# Altium schematic sheet LionIRVT-TM4C_Main.SchDoc
size A3
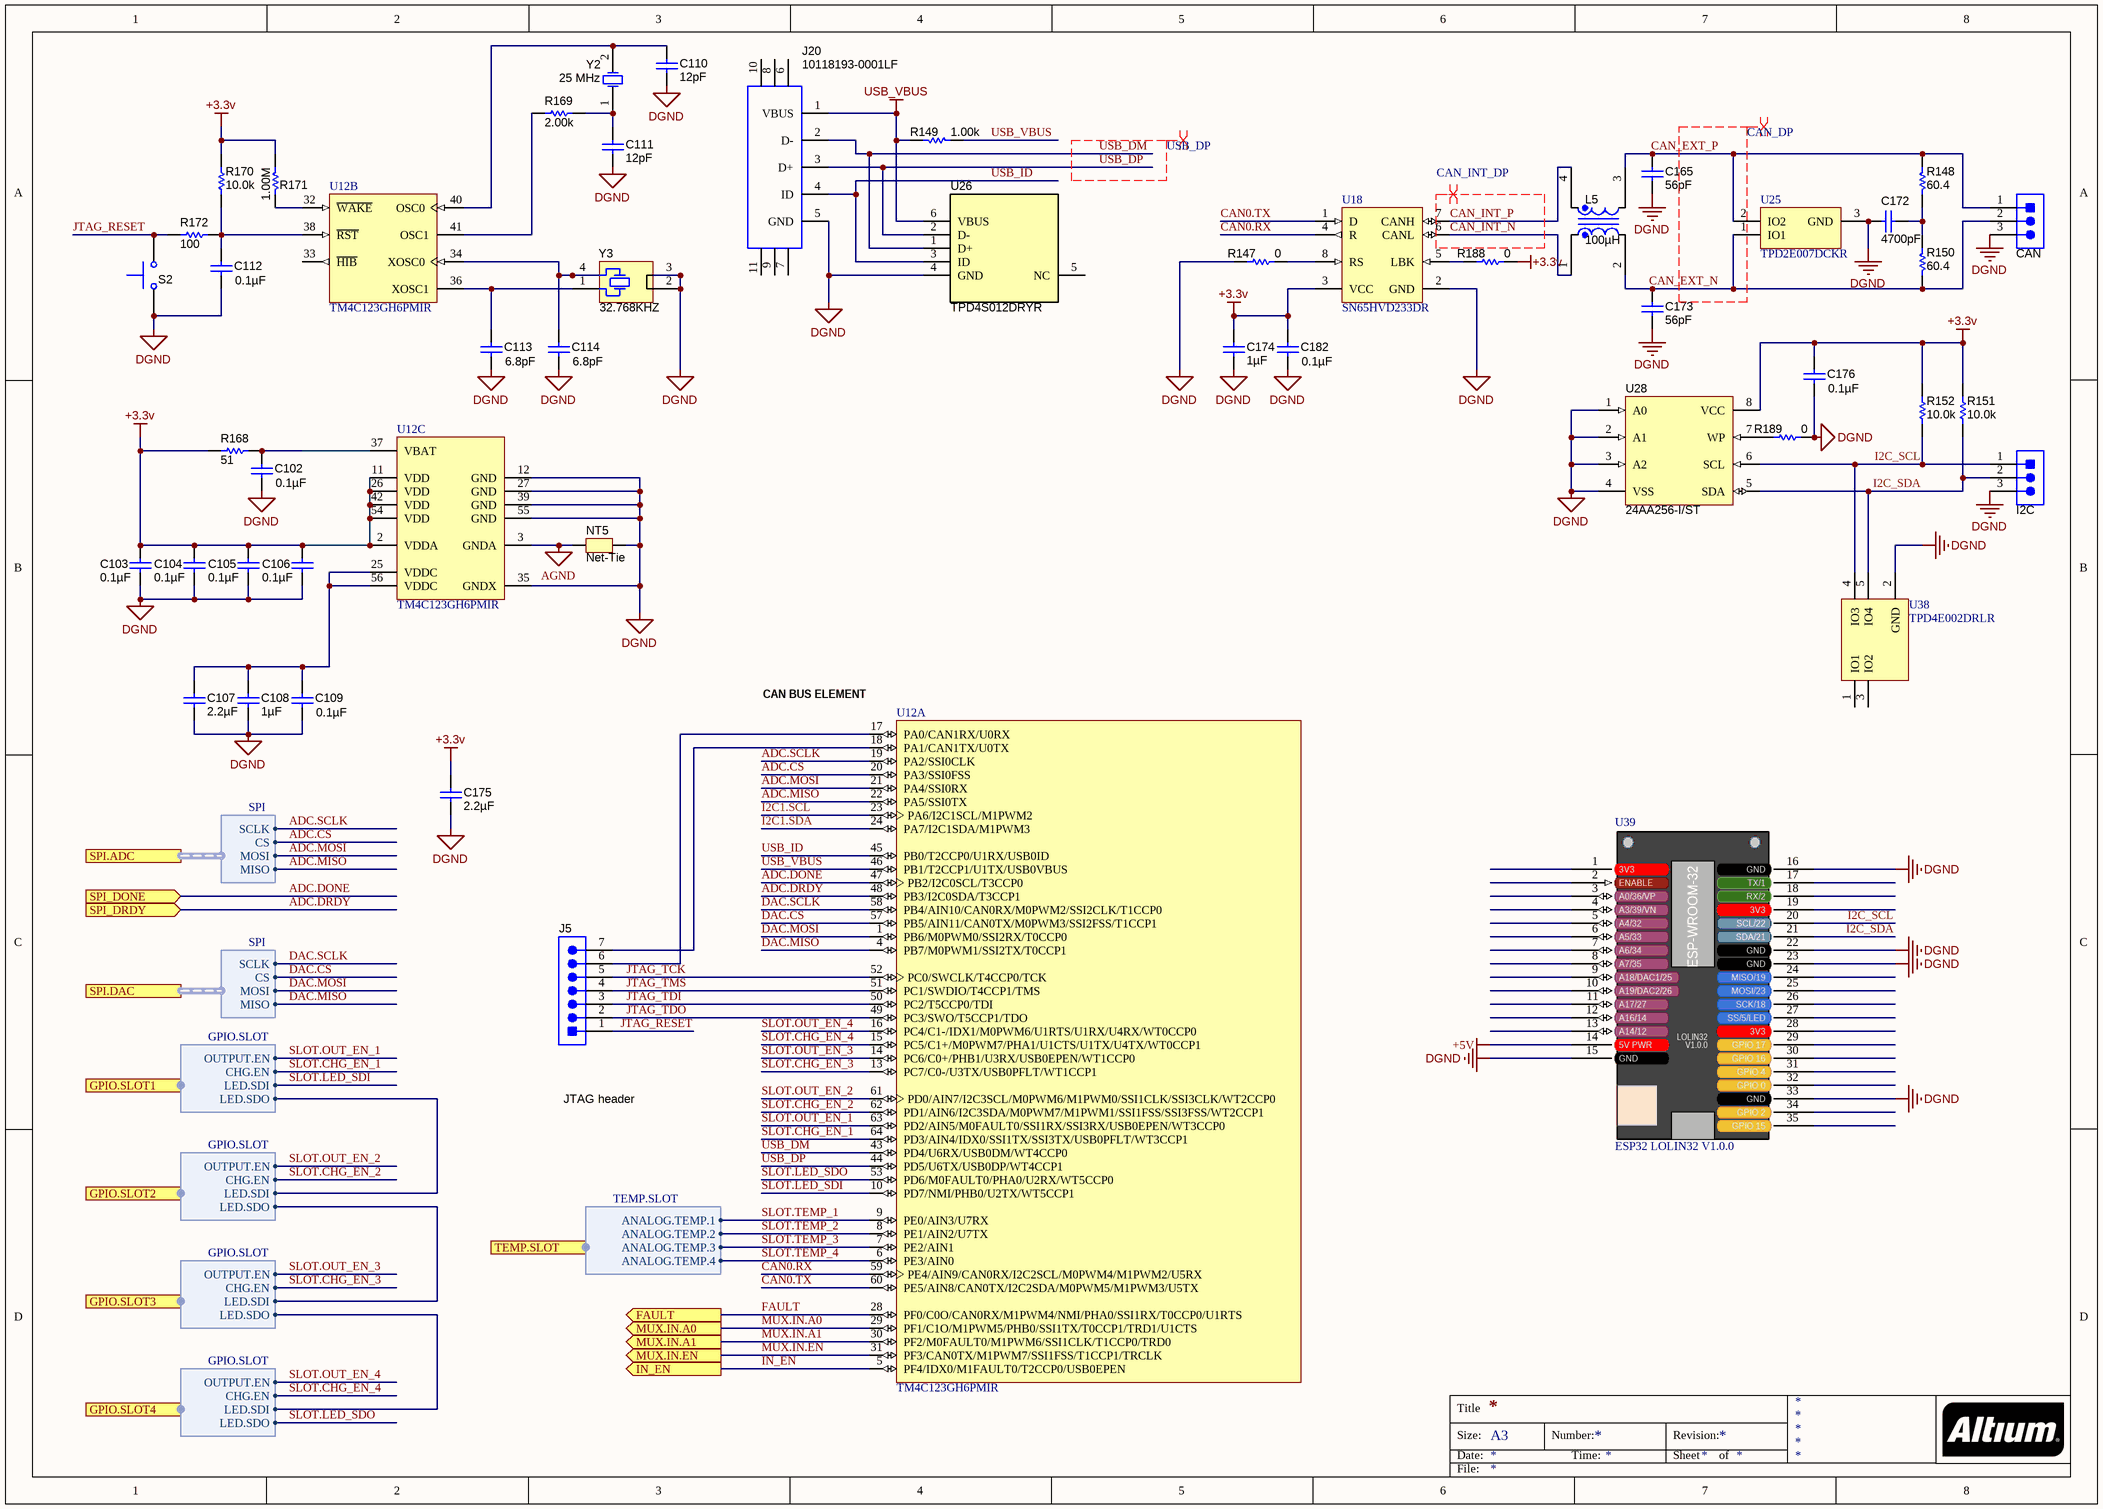
[diagram p0: LionIRVT-TM4C_Main.SchDoc]

## Parts
C102  ValueDisplayed: 0.1µF  [0603C]  (hidden comment: 06033C104JAT2A)
C103  ValueDisplayed: 0.1µF  [0603C]  (hidden comment: 06033C104JAT2A)
C104  ValueDisplayed: 0.1µF  [0603C]  (hidden comment: 06033C104JAT2A)
C105  ValueDisplayed: 0.1µF  [0603C]  (hidden comment: 06033C104JAT2A)
C106  ValueDisplayed: 0.1µF  [0603C]  (hidden comment: 06033C104JAT2A)
C107  ValueDisplayed: 2.2µF  [0603C]  (hidden comment: GRM188R6YA225KA12D)
C108  ValueDisplayed: 1µF  [0603C]  (hidden comment: GRM188R71E105KA12D)
C109  ValueDisplayed: 0.1µF  [0603C]  (hidden comment: 06033C104JAT2A)
C110  ValueDisplayed: 12pF  [0603C]  (hidden comment: C0603C120J5GACTU)
C111  ValueDisplayed: 12pF  [0603C]  (hidden comment: C0603C120J5GACTU)
C112  ValueDisplayed: 0.1µF  [0603C]  (hidden comment: 06033C104JAT2A)
C113  ValueDisplayed: 6.8pF  [0603C]  (hidden comment: 06035A6R8CAT2A)
C114  ValueDisplayed: 6.8pF  [0603C]  (hidden comment: 06035A6R8CAT2A)
C165  ValueDisplayed: 56pF  [0603C]  (hidden comment: GRM1885C1H560JA01D)
C172  ValueDisplayed: 4700pF  [0603C]  (hidden comment: GCM188R71H472KA37D)
C173  ValueDisplayed: 56pF  [0603]  (hidden comment: GRM1885C1H560JA01D)
C174  ValueDisplayed: 1µF  [0603]  (hidden comment: GRM188R71E105KA12D)
C175  ValueDisplayed: 2.2µF  [0603]  (hidden comment: GRM188R6YA225KA12D)
C176  ValueDisplayed: 0.1µF  [0603C]  (hidden comment: 06033C104JAT2A)
C182  ValueDisplayed: 0.1µF  [0603C]  (hidden comment: 06033C104JAT2A)
CAN  ED555/3DS  [TERM_BLK_ED555-3DS]  (value not drawn)
I2C  ED555/3DS  [TERM_BLK_ED555-3DS]  (value not drawn)
J5  TSW-107-07-G-S  [TSW-107-07-G-S]  (value not drawn)
J20  10118193-0001LF  [FCI_10118193-0001LF]
L5  ValueDisplayed: 100µH  [SIMDAD_1812]  (hidden comment: B82789C0104H001)
NT5  Net-Tie  [Net-Tie_10mil]  (net tie, no BOM)
R147  ValueDisplayed: 0  [0603R]  (hidden comment: Resistor)
R148  ValueDisplayed: 60.4  [1206R]  (hidden comment: CRCW120660R4FKEA)
R149  ValueDisplayed: 1.00k  [0603R]  (hidden comment: CRCW06031K00FKEA)
R150  ValueDisplayed: 60.4  [1206R]  (hidden comment: CRCW120660R4FKEA)
R151  ValueDisplayed: 10.0k  [0603R]  (hidden comment: CRCW060310K0FKEA)
R152  ValueDisplayed: 10.0k  [0603R]  (hidden comment: CRCW060310K0FKEA)
R168  ValueDisplayed: 51  [0603R]  (hidden comment: CRCW060351R0JNEA)
R169  ValueDisplayed: 2.00k  [0603R]  (hidden comment: CRCW06032K00FKEA)
R170  ValueDisplayed: 10.0k  [0603R]  (hidden comment: CRCW060310K0FKEA)
R171  ValueDisplayed: 1.00M  [0603R]  (hidden comment: CRCW06031M00FKEA)
R172  ValueDisplayed: 100  [0603R]  (hidden comment: CRCW0603100RFKEA)
R188  ValueDisplayed: 0  [0603R]  (hidden comment: Resistor)
R189  ValueDisplayed: 0  [0603R]  (hidden comment: Resistor)
S2  TL1015AF160QG  [SW_TL1015AF160QG]  (value not drawn)
U12  TM4C123GH6PMIR  [PM0064A_L]  (parts A,B,C of 3)
U18  SN65HVD233DR  [D0008A_M]
U25  TPD2E007DCKR  [DCK0003A_M]
U26  TPD4S012DRYR  [DRY0006A]
U28  24AA256-I/ST  [TSSOP-8]
U38  TPD4E002DRLR  [DRL0005A_L]
U39  ESP32 LOLIN32 V1.0.0  [ESP32_LOLIN32_V1]
Y2  Frequency: 25 MHz  [XTAL_ABM3]  (hidden comment: ABM3-25.000MHZ-D2Y-T)
Y3  Frequency: 32.768KHZ  [Seiko_SSP-T]  (hidden comment: SSPT7F-7PF20-R)

## Ports
FAULT (out), GPIO.SLOT1 (harness GPIO.SLOT), GPIO.SLOT2 (harness GPIO.SLOT), GPIO.SLOT3 (harness GPIO.SLOT), GPIO.SLOT4 (harness GPIO.SLOT), IN_EN (out), MUX.IN.A0 (out), MUX.IN.A1 (out), MUX.IN.EN (out), SPI.ADC (harness SPI), SPI.DAC (harness SPI), SPI_DONE (in), SPI_DRDY (in), TEMP.SLOT (harness TEMP.SLOT)

## Harnesses
SPI: CS, MISO, MOSI, SCLK
GPIO.SLOT: LED.SDI, CHG.EN, LED.SDO, OUTPUT.EN
GPIO.SLOT: CHG.EN, OUTPUT.EN, LED.SDO, LED.SDI
GPIO.SLOT: CHG.EN, OUTPUT.EN, LED.SDI, LED.SDO
TEMP.SLOT: ANALOG.TEMP.1, ANALOG.TEMP.2, ANALOG.TEMP.3, ANALOG.TEMP.4

## Nets
+3.3v: C103.2 C104.2 C105.2 C106.2 C174.1 C175.1 C176.2 C182.2 R151.2 R152.2 R168.1 R170.2 R171.2 R188.2 U12.2(VDDA) U12.11(VDD) U12.26(VDD) U12.42(VDD) U12.54(VDD) U18.3(VCC) U28.8(VCC)
+5V: U39.14(5V_PWR)
AGND: NT5.1 U12.3(GNDA)
DGND: C102.1 C103.1 C104.1 C105.1 C106.1 C107.2 C108.2 C109.1 C110.2 C111.2 C112.1 C113.1 C114.1 C165.2 C172.1 C173.2 C174.2 C175.2 C176.1 C182.1 CAN.3 I2C.3 J20.5(GND) NT5.2 R147.1 R189.2 S2.1 U12.12(GND) U12.27(GND) U12.35(GNDX) U12.39(GND) U12.55(GND) U18.2(GND) U25.3(GND) U26.4(GND) U28.1(A0) U28.2(A1) U28.3(A2) U28.4(VSS) U38.2(GND) U39.15(GND) U39.16(GND) U39.22(GND) U39.23(GND) U39.33(GND) Y3.2 Y3.3
USB_VBUS: J20.1(VBUS) R149.1 R149.2 U12.46(PB1/T2CCP1/U1TX/USB0VBUS) U26.6(VBUS)
ADC.CS: U12.20(PA3/SSI0FSS) ; port SPI.ADC.CS
ADC.DONE: U12.47(PB2/I2C0SCL/T3CCP0) ; port SPI_DONE
ADC.DRDY: U12.48(PB3/I2C0SDA/T3CCP1) ; port SPI_DRDY
ADC.MISO: U12.22(PA5/SSI0TX) ; port SPI.ADC.MISO
ADC.MOSI: U12.21(PA4/SSI0RX) ; port SPI.ADC.MOSI
ADC.SCLK: U12.19(PA2/SSI0CLK) ; port SPI.ADC.SCLK
CAN0.RX: U12.59(PE4/AIN9/CAN0RX/I2C2SCL/M0PWM4/M1PWM2/U5RX) U18.4(R)
CAN0.TX: U12.60(PE5/AIN8/CAN0TX/I2C2SDA/M0PWM5/M1PWM3/U5TX) U18.1(D)
CAN_EXT_N: C173.1 CAN.2 L5.2 R150.1 U25.1(IO1)
CAN_EXT_P: C165.1 CAN.1 L5.3 R148.2 U25.2(IO2)
CAN_INT_N: L5.1 U18.6(CANL)
CAN_INT_P: L5.4 U18.7(CANH)
DAC.CS: U12.57(PB5/AIN11/CAN0TX/M0PWM3/SSI2FSS/T1CCP1) ; port SPI.DAC.CS
DAC.MISO: U12.4(PB7/M0PWM1/SSI2TX/T0CCP1) ; port SPI.DAC.MISO
DAC.MOSI: U12.1(PB6/M0PWM0/SSI2RX/T0CCP0) ; port SPI.DAC.MOSI
DAC.SCLK: U12.58(PB4/AIN10/CAN0RX/M0PWM2/SSI2CLK/T1CCP0) ; port SPI.DAC.SCLK
FAULT: U12.28(PF0/C0O/CAN0RX/M1PWM4/NMI/PHA0/SSI1RX/T0CCP0/U1RTS) ; port FAULT
I2C1.SCL: U12.23(PA6/I2C1SCL/M1PWM2)
I2C1.SDA: U12.24(PA7/I2C1SDA/M1PWM3)
I2C_SCL: I2C.1 R152.1 U28.6(SCL) U38.4(IO3) U39.20(SCL/22)
I2C_SDA: I2C.2 R151.1 U28.5(SDA) U38.5(IO4) U39.21(SDA/21)
IN_EN: U12.5(PF4/IDX0/M1FAULT0/T2CCP0/USB0EPEN) ; port IN_EN
JTAG_RESET: J5.1 R172.1 S2.2
JTAG_TCK: J5.5 U12.52(PC0/SWCLK/T4CCP0/TCK)
JTAG_TDI: J5.3 U12.50(PC2/T5CCP0/TDI)
JTAG_TDO: J5.2 U12.49(PC3/SWO/T5CCP1/TDO)
JTAG_TMS: J5.4 U12.51(PC1/SWDIO/T4CCP1/TMS)
MUX.IN.A0: U12.29(PF1/C1O/M1PWM5/PHB0/SSI1TX/T0CCP1/TRD1/U1CTS) ; port MUX.IN.A0
MUX.IN.A1: U12.30(PF2/M0FAULT0/M1PWM6/SSI1CLK/T1CCP0/TRD0) ; port MUX.IN.A1
MUX.IN.EN: U12.31(PF3/CAN0TX/M1PWM7/SSI1FSS/T1CCP1/TRCLK) ; port MUX.IN.EN
SLOT.CHG_EN_1: U12.64(PD3/AIN4/IDX0/SSI1TX/SSI3TX/USB0PFLT/WT3CCP1) ; port GPIO.SLOT1.CHG.EN
SLOT.CHG_EN_2: U12.62(PD1/AIN6/I2C3SDA/M0PWM7/M1PWM1/SSI1FSS/SSI3FSS/WT2CCP1) ; port GPIO.SLOT2.CHG.EN
SLOT.CHG_EN_3: U12.13(PC7/C0-/U3TX/USB0PFLT/WT1CCP1) ; port GPIO.SLOT3.CHG.EN
SLOT.CHG_EN_4: U12.15(PC5/C1+/M0PWM7/PHA1/U1CTS/U1TX/U4TX/WT0CCP1) ; port GPIO.SLOT4.CHG.EN
SLOT.LED_SDI: U12.10(PD7/NMI/PHB0/U2TX/WT5CCP1) ; port GPIO.SLOT1.LED.SDI
SLOT.LED_SDO: U12.53(PD6/M0FAULT0/PHA0/U2RX/WT5CCP0) ; port GPIO.SLOT4.LED.SDO
SLOT.OUT_EN_1: U12.63(PD2/AIN5/M0FAULT0/SSI1RX/SSI3RX/USB0EPEN/WT3CCP0) ; port GPIO.SLOT1.OUTPUT.EN
SLOT.OUT_EN_2: U12.61(PD0/AIN7/I2C3SCL/M0PWM6/M1PWM0/SSI1CLK/SSI3CLK/WT2CCP0) ; port GPIO.SLOT2.OUTPUT.EN
SLOT.OUT_EN_3: U12.14(PC6/C0+/PHB1/U3RX/USB0EPEN/WT1CCP0) ; port GPIO.SLOT3.OUTPUT.EN
SLOT.OUT_EN_4: U12.16(PC4/C1-/IDX1/M0PWM6/U1RTS/U1RX/U4RX/WT0CCP0) ; port GPIO.SLOT4.OUTPUT.EN
SLOT.TEMP_1: U12.9(PE0/AIN3/U7RX) ; port TEMP.SLOT.ANALOG.TEMP.1
SLOT.TEMP_2: U12.8(PE1/AIN2/U7TX) ; port TEMP.SLOT.ANALOG.TEMP.2
SLOT.TEMP_3: U12.7(PE2/AIN1) ; port TEMP.SLOT.ANALOG.TEMP.3
SLOT.TEMP_4: U12.6(PE3/AIN0) ; port TEMP.SLOT.ANALOG.TEMP.4
USB_DM: J20.2(D-) U12.43(PD4/U6RX/USB0DM/WT4CCP0) U26.1(D+)
USB_DP: J20.3(D+) U12.44(PD5/U6TX/USB0DP/WT4CCP1) U26.2(D-)
USB_ID: J20.4(ID) U12.45(PB0/T2CCP0/U1RX/USB0ID) U26.3(ID)
NetC102_2: C102.2 R168.2 U12.37(VBAT)
NetC107_1: C107.1 C108.1 C109.2 U12.25(VDDC) U12.56(VDDC)
NetC110_1: C110.1 U12.40(OSC0) Y2.2(OSC2)
NetC111_1: C111.1 R169.1 Y2.1(OSC1)
NetC112_2: C112.2 R170.1 R172.2 U12.38(~{RST})
NetC113_2: C113.2 U12.36(XOSC1) Y3.1
NetC114_2: C114.2 U12.34(XOSC0) Y3.4
NetC172_2: C172.2 R148.1 R150.2
NetJ5_6: J5.6 U12.17(PA0/CAN1RX/U0RX)
NetJ5_7: J5.7 U12.18(PA1/CAN1TX/U0TX)
NetR147_2: R147.2 U18.8(RS)
NetR169_2: R169.2 U12.41(OSC1)
NetR171_1: R171.1 U12.32(~{WAKE})
NetR188_1: R188.1 U18.5(LBK)
NetR189_1: R189.1 U28.7(WP)
(unnamed): port GPIO.SLOT1.LED.SDO, port GPIO.SLOT2.LED.SDI
(unnamed): port GPIO.SLOT2.LED.SDO, port GPIO.SLOT3.LED.SDI
(unnamed): port GPIO.SLOT3.LED.SDO, port GPIO.SLOT4.LED.SDI

Not connected (* = marked no-connect by the designer): J20 6 7 8 9 10 11; U12 33(~{HIB}); U26 5(NC); U38 1(IO1) 3(IO2); U39 1(3V3) 2(ENABLE) 3(A0/36/VP) 4(A3/39/VN) 5(A4/32) 6(A5/33) 7(A6/34) 8(A7/35) 9(A18/DAC1/25) 10(A19/DAC2/26) 11(A17/27) 12(A16/14) 13(A14/12) 17(TX/1) 18(RX/2) 19(3V3) 24(MISO/19) 25(MOSI/23) 26(SCK/18) 27(SS/5/LED) 28(3V3) 29(GPIO_17) 30(GPIO_16) 31(GPIO_4) 32(GPIO_0) 34(GPIO_2) 35(GPIO_15)

## Layout directives
differential pair; differential pair class CAN_DP: CAN_EXT_N, CAN_EXT_P
differential pair; differential pair class CAN_INT_DP: CAN_INT_N, CAN_INT_P
differential pair; differential pair class USB_DP: USB_DM, USB_DP

## Notes on the sheet
- (near U12) CAN BUS ELEMENT
- JTAG header
- Title
- Size:
- Date:
- A3
- Number:
- Time:
- Revision:
- Sheet
- of
- File:
- (in symbol ESP32_WLOIN) ESP-WROOM-32; LOLIN32; V1.0.0

## Library data of the parts
C102-C106 C109 C112 C176 C182 = 06033C104JAT2A: CAP, CERM, 0.1 µF, 25 V, +/- 5%, X7R, 0603; Manufacturer: AVX; Polarized: N; CompType: Capacitor; Value: 0.1uF; U/M: EA; Cap_F: 0.0000001; Tolerance_%: 5; ESR_ohm: 0.05; Value1: 0.05 ohm; VDC_V: 25; Value2: 25V; TaMin_C: -55; TaMax_C: 125; Cap_Case: 0603; AEC Category: Q200; SymbolVersion: 2008-07-09; PartNumber: 06033C104JAT2A; PackageReference: 0603; RoHS: Y; MountType: SMT; Technology: Ceramic; TempCo: X7R; Published: 2008-06-19; Publisher: Texas Instruments; LatestRevisionDate: 2015-10-23; ComponentLink1Description: Datasheet link; ComponentLink1URL: http://www.avx.com/docs/masterpubs/smccp.pdf; Supplier 1: Digi-Key; Supplier Part Number 1: 478-3713-1-ND; Supplier 2: Mouser; Supplier Part Number 2: 581-06033C104JAT2A; Supplier 3: Farnell; Supplier Part Number 3: 1740614; AEC Qualified: ?
C107 = GRM188R6YA225KA12D: CAP, CERM, 2.2 µF, 35 V, +/- 10%, X5R, 0603; Manufacturer: MuRata; Polarized: N; CompType: Capacitor; Value: 2.2uF; U/M: EA; Cap_F: 0.0000022; Tolerance_%: 10; Value1: Unknown; VDC_V: 35; Value2: 35V; TaMin_C: -55; TaMax_C: 85; Cap_Case: 0603; AEC Category: Q200; SymbolVersion: 2008-07-09; PartNumber: GRM188R6YA225KA12D; PackageReference: 0603; RoHS: Y; MountType: SMT; Technology: Ceramic; TempCo: X5R; Published: 2008-06-19; Publisher: Texas Instruments; LatestRevisionDate: 2015-10-23; ComponentLink1Description: Datasheet link; ComponentLink1URL: http://search.murata.co.jp/Ceramy/image/img/A01X/G101/ENG/GRM188R6YA225KA12-01.pdf; Supplier 1: Digi-Key; Supplier Part Number 1: 490-7204-6-ND; AEC Qualified: ?
C108 = GRM188R71E105KA12D: CAP, CERM, 1 µF, 25 V, +/- 10%, X7R, 0603; Manufacturer: MuRata; Polarized: N; CompType: Capacitor; Value: 1uF; U/M: EA; Cap_F: 0.000001; Tolerance_%: 10; Value1: Unknown; VDC_V: 25; Value2: 25V; TaMin_C: -55; TaMax_C: 125; Cap_Case: 0603; AEC Category: Q200; SymbolVersion: 2008-07-09; PartNumber: GRM188R71E105KA12D; PackageReference: 0603; RoHS: Y; MountType: SMT; Technology: Ceramic; TempCo: X7R; Published: 2008-06-19; Publisher: Texas Instruments; LatestRevisionDate: 2015-10-23; ComponentLink1Description: Datasheet link; ComponentLink1URL: http://search.murata.co.jp/Ceramy/PnsearchViewAction.do?HnOFG=ON&HnNFG=ON&SEL_CNT=50&sLang=en&sKey=GRM188R71E105KA12D&x=9&y=9&search=startwith; Supplier 1: Digi-Key; Supplier Part Number 1: 490-5307-1-ND; Supplier 2: Mouser; Supplier Part Number 2: 81-GRM188R71E105KA2D; Supplier 3: Farnell; Supplier Part Number 3: 1735540; AEC Qualified: ?
C110 C111 = C0603C120J5GACTU: CAP, CERM, 12 pF, 50 V, +/- 5%, C0G/NP0, 0603; Manufacturer: Kemet; Polarized: N; CompType: Capacitor; Value: 12pF; U/M: EA; Cap_F: 0.000000000012; Tolerance_%: 5; Value1: Unknown; VDC_V: 50; Value2: 50V; TaMin_C: -55; TaMax_C: 125; Cap_Case: 0603; AEC Category: Q200; SymbolVersion: 2008-07-09; PartNumber: C0603C120J5GACTU; PackageReference: 0603; RoHS: Y; MountType: SMT; Technology: Ceramic; TempCo: C0G/NP0; Published: 2008-06-19; Publisher: Texas Instruments; LatestRevisionDate: 2015-10-23; ComponentLink1Description: Datasheet link; ComponentLink1URL: http://www.kemet.com/kemet/web/homepage/kechome.nsf/vapubfiles/F3102_Y5V.pdf/$file/F3102_Y5V.pdf; Supplier 1: Digi-Key; Supplier Part Number 1: 399-1050-1-ND; Supplier 2: Mouser; Supplier Part Number 2: 80-C0603C120J5G; Supplier 3: Farnell; Supplier Part Number 3: 1414612; AEC Qualified: ?
C113 C114 = 06035A6R8CAT2A: CAP, CERM, 6.8 pF, 50 V, +/- 4%, C0G/NP0, 0603; Manufacturer: AVX; Polarized: N; CompType: Capacitor; Value: 6.8pF; U/M: EA; Cap_F: 0.0000000000068; Tolerance_%: 4; ESR_ohm: 0.505; Value1: 0.505 ohm; VDC_V: 50; Value2: 50V; TaMin_C: -55; TaMax_C: 125; Cap_Case: 0603; AEC Category: Q200; SymbolVersion: 2008-07-09; PartNumber: 06035A6R8CAT2A; PackageReference: 0603; RoHS: Y; MountType: SMT; Technology: Ceramic; TempCo: C0G/NP0; Published: 2008-06-19; Publisher: Texas Instruments; LatestRevisionDate: 2015-10-23; ComponentLink1Description: Datasheet link; ComponentLink1URL: http://www.avx.com/docs/masterpubs/smccp.pdf; Supplier 1: Digi-Key; Supplier Part Number 1: 478-1161-1-ND; Supplier 2: Mouser; Supplier Part Number 2: 581-06035A6R8CAT2A; Supplier 3: Farnell; Supplier Part Number 3: 1396258; AEC Qualified: ?
C165 = GRM1885C1H560JA01D: CAP, CERM, 56 pF, 50 V, +/- 5%, C0G/NP0, 0603; Manufacturer: MuRata; Polarized: N; CompType: Capacitor; Value: 56pF; U/M: EA; Cap_F: 0.000000000056; Tolerance_%: 5; Value1: Unknown; VDC_V: 50; Value2: 50V; TaMin_C: -55; TaMax_C: 125; Cap_Case: 0603; SizeArea_mm2: 1.28; SizeAreaWB_mm2: 4.68; SizeX_mm: 1.6; SizeY_mm: 0.8; SizeZ_mm: 1; AEC Category: Q200; SymbolVersion: 2008-07-09; PartNumber: GRM1885C1H560JA01D; PackageReference: 0603; RoHS: Y; MountType: SMT; Technology: Ceramic; TempCo: C0G/NP0; Published: 2008-06-19; Publisher: Texas Instruments; LatestRevisionDate: 2017-03-07; ComponentLink1Description: Datasheet link; ComponentLink1URL: http://search.murata.co.jp/Ceramy/PnsearchViewAction.do?HnOFG=ON&HnNFG=ON&SEL_CNT=50&sLang=en&sKey=GRM1885C1H560JA01D&x=9&y=9&search=startwith; Supplier 1: Digi-Key; Supplier Part Number 1: 490-1421-1-ND; Supplier 2: Mouser; Supplier Part Number 2: 81-GRM39C560J50; Supplier 3: Farnell; Supplier Part Number 3: 1828911; AEC Qualified: ?
C172 = GCM188R71H472KA37D: CAP, CERM, 4700 pF, 50 V, +/- 10%, X7R, AEC-Q200 Grade 1, 0603; Manufacturer: MuRata; Polarized: N; CompType: Capacitor; Value: 4700pF; U/M: EA; Cap_F: 0.0000000047; Tolerance_%: 10; Value1: Unknown; VDC_V: 50; Value2: 50V; TaMin_C: -55; TaMax_C: 125; Cap_Case: 0603; SizeArea_mm2: 1.28; SizeAreaWB_mm2: 4.68; SizeX_mm: 1.6; SizeY_mm: 0.8; SizeZ_mm: 1; AEC Category: Q200; AEC Qualified: Y; SymbolVersion: 2008-07-09; PartNumber: GCM188R71H472KA37D; PackageReference: 0603; RoHS: Y; MountType: SMT; Technology: Ceramic; TempCo: X7R; Published: 2008-06-19; Publisher: Texas Instruments; LatestRevisionDate: 2017-03-07; ComponentLink1Description: Datasheet link; ComponentLink1URL: http://psearch.murata.com/capacitor/product/GCM188R71H472KA37%23.pdf; Supplier 1: Digi-Key; Supplier Part Number 1: 490-4932-1-ND; Supplier 2: Mouser; Supplier Part Number 2: 81-GCM188R71H472K37D; AEC Grade: 1
C173 = GRM1885C1H560JA01D: CAP, CERM, 56 pF, 50 V, +/- 5%, C0G/NP0, 0603; Manufacturer: MuRata; Polarized: N; CompType: Capacitor; Value: 56pF; U/M: EA; Cap_F: 0.000000000056; Tolerance_%: 5; Value1: Unknown; VDC_V: 50; Value2: 50V; TaMin_C: -55; TaMax_C: 125; SizeArea_mm2: 1.28; SizeAreaWB_mm2: 4.68; SizeX_mm: 1.6; SizeY_mm: 0.8; SizeZ_mm: 1; AEC Category: Q200; SymbolVersion: 2008-07-09; PartNumber: GRM1885C1H560JA01D; PackageReference: 0603; RoHS: Y; MountType: SMT; Technology: Ceramic; TempCo: C0G/NP0; Cap_Case: 0603; Published: 2008-06-19; Publisher: Texas Instruments; LatestRevisionDate: 2017-03-07; ComponentLink1Description: Datasheet link; ComponentLink1URL: http://search.murata.co.jp/Ceramy/PnsearchViewAction.do?HnOFG=ON&HnNFG=ON&SEL_CNT=50&sLang=en&sKey=GRM1885C1H560JA01D&x=9&y=9&search=startwith; Supplier 1: Digi-Key; Supplier Part Number 1: 490-1421-1-ND; Supplier 2: Mouser; Supplier Part Number 2: 81-GRM39C560J50; Supplier 3: Farnell; Supplier Part Number 3: 1828911; AEC Qualified: ?
C174 = GRM188R71E105KA12D: CAP, CERM, 1 µF, 25 V, +/- 10%, X7R, 0603; Manufacturer: MuRata; Polarized: N; CompType: Capacitor; Value: 1uF; U/M: EA; Cap_F: 0.000001; Tolerance_%: 10; Value1: Unknown; VDC_V: 25; Value2: 25V; TaMin_C: -55; TaMax_C: 125; AEC Category: Q200; SymbolVersion: 2008-07-09; PartNumber: GRM188R71E105KA12D; PackageReference: 0603; RoHS: Y; MountType: SMT; Technology: Ceramic; TempCo: X7R; Cap_Case: 0603; Published: 2008-06-19; Publisher: Texas Instruments; LatestRevisionDate: 2015-10-23; ComponentLink1Description: Datasheet link; ComponentLink1URL: http://search.murata.co.jp/Ceramy/PnsearchViewAction.do?HnOFG=ON&HnNFG=ON&SEL_CNT=50&sLang=en&sKey=GRM188R71E105KA12D&x=9&y=9&search=startwith; Supplier 1: Digi-Key; Supplier Part Number 1: 490-5307-1-ND; Supplier 2: Mouser; Supplier Part Number 2: 81-GRM188R71E105KA2D; Supplier 3: Farnell; Supplier Part Number 3: 1735540; AEC Qualified: ?
C175 = GRM188R6YA225KA12D: CAP, CERM, 2.2 µF, 35 V, +/- 10%, X5R, 0603; Manufacturer: MuRata; Polarized: N; CompType: Capacitor; Value: 2.2uF; U/M: EA; Cap_F: 0.0000022; Tolerance_%: 10; Value1: Unknown; VDC_V: 35; Value2: 35V; TaMin_C: -55; TaMax_C: 85; AEC Category: Q200; SymbolVersion: 2008-07-09; PartNumber: GRM188R6YA225KA12D; PackageReference: 0603; RoHS: Y; MountType: SMT; Technology: Ceramic; TempCo: X5R; Cap_Case: 0603; Published: 2008-06-19; Publisher: Texas Instruments; LatestRevisionDate: 2015-10-23; ComponentLink1Description: Datasheet link; ComponentLink1URL: http://search.murata.co.jp/Ceramy/image/img/A01X/G101/ENG/GRM188R6YA225KA12-01.pdf; Supplier 1: Digi-Key; Supplier Part Number 1: 490-7204-6-ND; AEC Qualified: ?
CAN I2C = ED555/3DS: Terminal Block, 6A, 3.5mm Pitch, 3-Pos, TH; Manufacturer: On-Shore Technology; SymbolCreator: a0412235; CompType: Connector; U/M: EA; SymbolVersion: 2013-08-30; PartNumber: ED555/3DS; PackageReference: 14x8.2x6.5mm; RoHS: Y; MountType: TH; ComponentLink1Description: Datasheet Link; ComponentLink1URL: http://on-shore.com/sites/default/files/manuals/ed555ds.pdf; Publisher: Texas Instruments; LatestRevisionDate: 2014-09-28
J5 = TSW-107-07-G-S: Header, 100mil, 7x1, Gold, TH; Manufacturer: Samtec; SymbolCreator: a0411947; U/M: EA; SymbolVersion: 2013-12-22; PartNumber: TSW-107-07-G-S; PackageReference: 7x1 Header; ClassName: Header; CompType: Header; RoHS: Y; MountType: TH; ComponentLink1Description: Datasheet Link; ComponentLink1URL: http://samtec.com/ftppub/pdf/TSW_TH.PDF; Publisher: Texas Instruments; LatestRevisionDate: 2015-10-21; Supplier 1: Digi-Key; Supplier Part Number 1: SAM1029-07-ND
J20 = CMP-0065029-1: Connector, Receptacle, USB Micro B, R/A, SMT; Manufacturer: FCI; CNHeader: False; Gender: Female; Row_Count: 1; Pitch_mm: 0.65; ContactFinish: Gold; CT: True; ComponentLink1URL: https://sps06.itg.ti.com/sites/KMS/crossdivteams/altium/docs/ComponentDatasheets/10118193-0001LF.pdf; Supplier Part Number 2: 67T2259; Publisher: Texas Instruments; Supplier 2: Newark; Supplier Part Number 3: 649-10118193-0001LF; Color: Black; Supplier 3: Mouser; MountType: SMT; Supplier 1: Digi-Key; PackageReference: Connector, Receptacle, USB Micro B, R/A, SMT; PinCount: 5; CompType: USB; LatestRevisionDate: 2017-06-05; PartNumber: 10118193-0001LF; Orientation: R/A; ComponentLink1Description: Datasheet URL; Supplier Part Number 1: 609-4616-1-ND
L5 = B82789C0104H001: Coupled inductor, 100 µH, 0.15 A, 1.5 ohm, SMD; Manufacturer: TDK; SymbolCreator: a0412235; Value: 100uH; Ind_H: 100.0E-6; DCR_ohm: 1.5; SymbolVersion: 2013-02-26; PartNumber: B82789C0104H001; PackageReference: 4.5x3.0x3.2mm; MountType: SMT; ComponentLink1URL: http://www.epcos.com/inf/30/db/ind_2008/b82789c0_s0.pdf; ComponentLink1Description: Datasheet URL; RoHS: Y; CompType: Coupled Inductor; Publisher: Texas Instruments; Published: 2008-05-16; LatestRevisionDate: 2017-02-16; Supplier 1: Mouser; Supplier Part Number 1: 871-B82789C0104H001
NT5 = Net-Tie: Single point connection between nets.; SymbolCreator: codlsc; SymbolVersion: 2009-07-01; MountType: SMT; PackageReference: N/A; Publisher: Texas Instruments; LatestRevisionDate: 2014-10-27; LatestRevisionNote: Added Alternate PartNumber and Alternate Manufacturer parameters to appropriate components.
R147 R188 R189 = Resistor: RES, 0, 5%, 0.1 W, 0603; PartNumber: ERJ-3GEY0R00V; Manufacturer: Panasonic; Value: 0; Value_Code: 0000; Power_W: 100mW; Value2: 0.1W; VDC_V: 50V; TempCo: 600 ppm/C; EIA_Code: E24; U/M: EA; AEC Category: Q200; SizeArea_mm2: 1.28; SizeX_mm: 1.6; SizeY_mm: 0.8; SizeZ_mm: 1; CompType: Resistor; PackageReference: 0603; RoHS: Y; Res_ohm: 0; Tolerance_%: 5%; Value1: 5%; MountType: SMT; Technology: Thick Film; Published: 2008-06-26; Publisher: Texas Instruments; LatestRevisionDate: 2017-03-09; ComponentLink1Description: Datasheet link; ComponentLink1URL: http://www.panasonic.com/industrial/components/pdf/AOA0000CE1.pdf; Supplier 1: Digi-Key; Supplier Part Number 1: P0.0GCT-ND; Supplier 2: Mouser; Supplier Part Number 2: 667-ERJ-3GEY0R00V; Supplier 3: Farnell; Supplier Part Number 3: 2059527; AEC Qualified: ?
R148 R150 = CRCW120660R4FKEA: RES, 60.4, 1%, 0.25 W, 1206; Manufacturer: Vishay-Dale; CompType: Resistor; Value: 60.4; Value_Code: 60R4; Tolerance_%: 1; Power_W: 0.25; Value2: 0.25W; VDC_V: 200; TempCo: 100 ppm/C; SizeArea_mm2: 5.12; SizeX_mm: 3.2; SizeY_mm: 1.6; SizeZ_mm: 1.35; EIA_Code: E96; U/M: EA; AEC Category: Q200; SymbolVersion: 2009-05-29; PartNumber: CRCW120660R4FKEA; PackageReference: 1206; RoHS: Y; Res_ohm: 60.4; Value1: 1%; MountType: SMT; Technology: Thick Film; Published: 2008-06-26; Publisher: Texas Instruments; LatestRevisionDate: 2017-03-07; ComponentLink1Description: Datasheet link; ComponentLink1URL: http://www.vishay.com/docs/20035/dcrcwe3.pdf; Supplier 1: Digi-Key; Supplier Part Number 1: 541-60.4FCT-ND; Supplier 2: Newark; Supplier Part Number 2: 53K2546; Supplier 3: Mouser; Supplier Part Number 3: 71-CRCW1206-60.4-E3; AEC Qualified: ?
R149 = CRCW06031K00FKEA: RES, 1.00 k, 1%, 0.1 W, 0603; Manufacturer: Vishay-Dale; CompType: Resistor; Value: 1.00k; Res_ohm: 1000; Value_Code: 1k00; Tolerance_%: 1; Power_W: 0.1; Value2: 0.1W; VDC_V: 75; TempCo: 100 ppm/C; EIA_Code: E96; U/M: EA; AEC Category: Q200; SymbolVersion: 2009-05-29; PartNumber: CRCW06031K00FKEA; PackageReference: 0603; RoHS: Y; Value1: 1%; MountType: SMT; Technology: Thick Film; Published: 2008-06-26; Publisher: Texas Instruments; LatestRevisionDate: 2015-10-21; ComponentLink1Description: Datasheet link; ComponentLink1URL: http://www.vishay.com/docs/20035/dcrcwe3.pdf; Supplier 1: Digi-Key; Supplier Part Number 1: 541-1.00KHCT-ND; Supplier 2: Mouser; Supplier Part Number 2: 71-CRCW0603-1.0K-E3; Supplier 3: Farnell; Supplier Part Number 3: 1469740; AEC Qualified: ?
R151 R152 R170 = CRCW060310K0FKEA: RES, 10.0 k, 1%, 0.1 W, 0603; Manufacturer: Vishay-Dale; CompType: Resistor; Value: 10.0k; Res_ohm: 10000; Value_Code: 10k0; Tolerance_%: 1; Power_W: 0.1; Value2: 0.1W; VDC_V: 75; TempCo: 100 ppm/C; EIA_Code: E96; U/M: EA; AEC Category: Q200; SymbolVersion: 2009-05-29; PartNumber: CRCW060310K0FKEA; PackageReference: 0603; RoHS: Y; Value1: 1%; MountType: SMT; Technology: Thick Film; Published: 2008-06-26; Publisher: Texas Instruments; LatestRevisionDate: 2015-10-21; ComponentLink1Description: Datasheet link; ComponentLink1URL: http://www.vishay.com/docs/20035/dcrcwe3.pdf; Supplier 1: Digi-Key; Supplier Part Number 1: 541-10.0KHCT-ND; Supplier 2: Mouser; Supplier Part Number 2: 71-CRCW0603-10K-E3; Supplier 3: Farnell; Supplier Part Number 3: 1469748; AEC Qualified: ?
R168 = CRCW060351R0JNEA: RES, 51, 5%, 0.1 W, 0603; Manufacturer: Vishay-Dale; CompType: Resistor; Value: 51; Value_Code: 51R0; Tolerance_%: 5; Power_W: 0.1; Value2: 0.1W; VDC_V: 75; TempCo: 200 ppm/C; EIA_Code: E24; U/M: EA; AEC Category: Q200; SymbolVersion: 2009-05-29; PartNumber: CRCW060351R0JNEA; PackageReference: 0603; RoHS: Y; Res_ohm: 51; Value1: 5%; MountType: SMT; Technology: Thick Film; Published: 2008-06-26; Publisher: Texas Instruments; LatestRevisionDate: 2015-10-21; ComponentLink1Description: Datasheet link; ComponentLink1URL: http://www.vishay.com/docs/20035/dcrcwe3.pdf; Supplier 1: Digi-Key; Supplier Part Number 1: 541-51GCT-ND; Supplier 2: Mouser; Supplier Part Number 2: 71-CRCW0603J-51-E3; Supplier 3: Farnell; Supplier Part Number 3: 1514778; AEC Qualified: ?
R169 = CRCW06032K00FKEA: RES, 2.00 k, 1%, 0.1 W, 0603; Manufacturer: Vishay-Dale; CompType: Resistor; Value: 2.00k; Res_ohm: 2000; Value_Code: 2k00; Tolerance_%: 1; Power_W: 0.1; Value2: 0.1W; VDC_V: 75; TempCo: 100 ppm/C; EIA_Code: E96; U/M: EA; AEC Category: Q200; SymbolVersion: 2009-05-29; PartNumber: CRCW06032K00FKEA; PackageReference: 0603; RoHS: Y; Value1: 1%; MountType: SMT; Technology: Thick Film; Published: 2008-06-26; Publisher: Texas Instruments; LatestRevisionDate: 2015-10-21; ComponentLink1Description: Datasheet link; ComponentLink1URL: http://www.vishay.com/docs/20035/dcrcwe3.pdf; Supplier 1: Digi-Key; Supplier Part Number 1: 541-2.00KHCT-ND; Supplier 2: Mouser; Supplier Part Number 2: 71-CRCW0603-2.0K-E3; Supplier 3: Farnell; Supplier Part Number 3: 1469764; AEC Qualified: ?
R171 = CRCW06031M00FKEA: RES, 1.00 M, 1%, 0.1 W, 0603; Manufacturer: Vishay-Dale; CompType: Resistor; Value: 1.00Meg; Res_ohm: 1000000; Value_Code: 1M00; Tolerance_%: 1; Power_W: 0.1; Value2: 0.1W; VDC_V: 75; TempCo: 100 ppm/C; EIA_Code: E96; U/M: EA; AEC Category: Q200; SymbolVersion: 2009-05-29; PartNumber: CRCW06031M00FKEA; PackageReference: 0603; RoHS: Y; Value1: 1%; MountType: SMT; Technology: Thick Film; Published: 2008-06-26; Publisher: Texas Instruments; LatestRevisionDate: 2015-10-21; ComponentLink1Description: Datasheet link; ComponentLink1URL: http://www.vishay.com/docs/20035/dcrcwe3.pdf; Supplier 1: Digi-Key; Supplier Part Number 1: 541-1.00MHCT-ND; Supplier 2: Mouser; Supplier Part Number 2: 71-CRCW0603-1.0M-E3; Supplier 3: Farnell; Supplier Part Number 3: 1469746; AEC Qualified: ?
R172 = CRCW0603100RFKEA: RES, 100, 1%, 0.1 W, 0603; Manufacturer: Vishay-Dale; CompType: Resistor; Value: 100; Value_Code: 100R; Tolerance_%: 1; Power_W: 0.1; Value2: 0.1W; VDC_V: 75; TempCo: 100 ppm/C; EIA_Code: E96; U/M: EA; AEC Category: Q200; SymbolVersion: 2009-05-29; PartNumber: CRCW0603100RFKEA; PackageReference: 0603; RoHS: Y; Res_ohm: 100; Value1: 1%; MountType: SMT; Technology: Thick Film; Published: 2008-06-26; Publisher: Texas Instruments; LatestRevisionDate: 2015-10-21; ComponentLink1Description: Datasheet link; ComponentLink1URL: http://www.vishay.com/docs/20035/dcrcwe3.pdf; Supplier 1: Digi-Key; Supplier Part Number 1: 541-100HCT-ND; Supplier 2: Mouser; Supplier Part Number 2: 71-CRCW0603-100-E3; Supplier 3: Farnell; Supplier Part Number 3: 1469752; AEC Qualified: ?
S2 = TL1015AF160QG: Switch, Tactile, SPST-NO, 0.05A, 12V, SMT; Manufacturer: E-Switch; SymbolCreator: a0412235; VDC_V: 12; SwitchFunction: Off-Mom; PositionCount: 1; CurrentRating_mA: 50; SymbolVersion: 2012-10-29; PartNumber: TL1015AF160QG; MountType: SMT; ComponentLink1Description: Datasheet URL; ComponentLink1URL: http://spec.e-switch.com/P-J/P420000.pdf; RoHS: Y; Circuit: SPST-NO; Orientation: Top Actuated; CompType: Switch; PackageReference: Switch, 4.4x2x2.9 mm; Publisher: Texas Instruments; LatestRevisionDate: 2015-10-14; Supplier 1: Digi-Key; Supplier Part Number 1: EG4344CT-ND; Supplier 2: Mouser; Supplier Part Number 2: 612-TL1015AF; Supplier 3: Farnell; Supplier Part Number 3: 2292962
U12 = CMP-0945-00002-2: Tiva C Series Microcontroller, 256 KB Flash, 32 KB SRAM, 12 Bit, 12 Channels, -40 to 85 degC, 64-Pin LQFP (PM), Green (RoHS & no Sb/Br), Tape and Reel; Manufacturer: Texas Instruments; Data Memory: 32 KB; UART: 4; Max Speed: 80 MHz; I2C: 2; GPIOs: 43; ADC Channels: 12; Program Memory: 256 KB; ADC Resolution: 12 Bit; Tiva Series: Connected MCUs; Prefix: Qualified Device; ComponentLink2URL: http://www.ti.com/lit/ds/symlink/tm4c123gh6pm.pdf; Temperature Range: -40 to 85 degC; ComponentLink2Description: Datasheet; DatasheetVersion: Rev. 15741.2722; ComponentLink1URL: http://www.ti.com/; PackageVersion: 4040152/C; PartNumber: TM4C123GH6PMIR; Mounting Technology: Surface Mount; Packing: Tape and Reel; PackageDescription: 64-Pin Plastic Quad Flatpack, Body 10 x 10 mm, Pitch 0.5 mm; ComponentLink3Description: Package Specification; PackageReference: PM0064A; RoHS: TRUE; ComponentLink1Description: Manufacturer URL; ComponentLink3URL: http://www.ti.com/litv/pdf/mtqf008a
U18 = CMP-0315-00038-2: 3.3V CAN Transceiver with Standby Mode, Loop-back, 6 mA, -40 to 125 degC, 8-pin SOIC (D), Green (RoHS & no Sb/Br); Manufacturer: Texas Instruments; Rating: Catalog; ICC(Max)(mA): 6; Receivers Per Package: 1; Supply Voltage(s)(V): 3.3; Transient Pulse Protection(V): -100 to 100; Bus Fault Voltage(V): +/-30; Footprint: PCA82C250, excludes pin5; Code_JEDEC: MS-012AA; PackageVersion: revM, Jun-2011; ComponentLink1Description: Datasheet; Mounting Technology: Surface Mount; SubFamily: CAN; DatasheetVersion: SLLS557F; PartNumber: SN65HVD233DR; PackageReference: D0008A; Drivers Per Package: 1; ComponentLink1URL: http://www.ti.com/general/docs/lit/getliterature.tsp?genericPartNumber=SN65HVD233&fileType=pdf; PackageDescription: 8-Pin Plastic Small Outline Integrated Circuit, 4.9 x 3.9 mm, Pitch 1.27 mm Pitch; Eco-Plan: Green (RoHS & no Sb/Br); Features: Loop Back; Low Power Mode: Standby; Isolated: No
U25 = CMP-0326-00069-3: ESD Protection Array for AC Signal Data Interface, 2 Channels, -40 to +85 degC, 3-pin SC70 (DCK), Green (RoHS & no Sb/Br); Manufacturer: Texas Instruments; IEC 61000-4-2 Contact(+/- kV): 8; IEC 61000-4-2 Air-Gap(+/- kV): 15; IO Leakage Current(nA): 50; SubFamily: ESD Solution; Breakdown Voltage(Min)(V): +/-14; ComponentLink2URL: http://www.ti.com/general/docs/lit/getliterature.tsp?genericPartNumber=TPD2E007&fileType=pdf; Mounting Technology: Surface Mount; ComponentLink1URL: http://www.ti.com/; PackageDescription: 3-Pin Plastic Small-Outline Package, 0.65 mm Pitch, 2.1 mm Lead Span; ComponentLink2Description: Datasheet; PackageReference: DCK0003A; DatasheetVersion: SLVS796E; Eco-Plan: Green (RoHS & no Sb/Br); PackageVersion: revG, Jan-2007; ComponentLink3Description: URL Link1; IO Capacitance(Typ)(pF): 15; ComponentLink3URL: SamplesURL:http://www.ti.com/product/tpd2e007#samples; PartNumber: TPD2E007DCKR; ComponentLink1Description: Manufacturer URL
U26 = CMP-0043122-2: USB ESD Solution with Power Clamp, 4 Channels, -40 to +85 degC, 6-pin SON (DRY), Green (RoHS & no Sb/Br); Manufacturer: Texas Instruments; IO Leakage Current(nA): 10; USB High Speed: TRUE; Breakdown Voltage(Min)(V): 6; IO Capacitance(Typ)(pF): 0.8; AEC Category: Q200; AEC Qualified: N; CompType: IC; SizeAreaWB_mm2: 4.9; SizeArea_mm2: 1.45; SizeX_mm: 1.0; SizeZ_mm: 0.6; SubFamily: ESD Solution; ComponentLink1Description: Datasheet Link; DatasheetVersion: SLVS928A; Eco-Plan: Green (RoHS & no Sb/Br); ComponentLink3URL: http://www.ti.com/product/tpd4s012/datasheet; PackageReference: DRY0006A; PartNumber: TPD4S012DRYR; ComponentLink3Description: Online Datasheet; PackageDescription: USON-6; Mounting Technology: Surface Mount; IEC 61000-4-2 Contact(+/- kV): 10; ComponentLink2Description: Product Folder; ComponentLink1URL: http://www.ti.com/lit/ds/symlink/tpd4s012.pdf; PackageVersion: revF, Dec-2011; ComponentLink2URL: http://www.ti.com/product/tpd4s012; IEC 61000-4-2 Air-Gap(+/- kV): 10; MountType: SMT; RoHS: Y; SizeY_mm: 1.45
U28 = 24AA256-I/ST: 256K I2C™ CMOS Serial EEPROM, TSSOP-8; Manufacturer: Microchip; SymbolCreator: a0411947; SymbolVersion: 2008-03-07; PartNumber: 24AA256-I/ST; MountType: SMT; ComponentLink1Description: Datasheet Link; ComponentLink1URL: http://www.microchip.com/mymicrochip/filehandler.aspx?ddocname=en011849; RoHS: Y; PackageReference: TSSOP-8; Publisher: Texas Instruments; LatestRevisionDate: 2015-10-26; Supplier 1: Digi-Key; Supplier Part Number 1: 24AA256-I/ST-ND; Supplier 2: Mouser; Supplier Part Number 2: 579-24AA256-I/ST
U38 = CMP-0326-00053-3: Low-Capacitance Array with + / - 15 kV ESD Protection, 4 Channels, -40 to +85 degC, 5-pin SOT (DRL), Green (RoHS & no Sb/Br); Manufacturer: Texas Instruments; IEC 61000-4-2 Contact(+/- kV): 15; Breakdown Voltage(Min)(V): 6; IO Capacitance(Typ)(pF): 11; SubFamily: ESD Solution; IO Leakage Current(nA): 100; ComponentLink3Description: URL Link1; ComponentLink3URL: SamplesURL:http://www.ti.com/product/tpd4e002#samples; PackageReference: DRL0005A; ComponentLink2Description: Datasheet; DatasheetVersion: SLVS615D; PackageVersion: revD, Aug-2007; ComponentLink1URL: http://www.ti.com/; ComponentLink1Description: Manufacturer URL; PackageDescription: 5-Pin Plastic Small Outline, Flat Lead 0.5 mm Pitch; Mounting Technology: Surface Mount; Eco-Plan: Green (RoHS & no Sb/Br); IEC 61000-4-2 Air-Gap(+/- kV): 15; PartNumber: TPD4E002DRLR; ComponentLink2URL: http://www.ti.com/general/docs/lit/getliterature.tsp?genericPartNumber=TPD4E002&fileType=pdf
U39 = ESP32_WLOIN
Y2 = ABM3-25.000MHZ-D2Y-T: Crystal, 25 MHz, 18 pF, SMD; Manufacturer: Abracon Corportation; SymbolCreator: a0412235; U/M: EA; TaMin_C: -40; TaMax_C: 85; Frequency Stability: ±30ppm; SymbolVersion: 2008-07-09; PartNumber: ABM3-25.000MHZ-D2Y-T; CompType: Crystal; PackageReference: ABM3; MountType: SMT; RoHS: Y; ComponentLink1Description: Datasheet Link; ComponentLink1URL: http://www.abracon.com/Resonators/abm3.pdf; Publisher: Texas Instruments; LatestRevisionDate: 2015-10-19; Supplier 1: Digi-Key; Supplier Part Number 1: 535-10645-1-ND; Supplier 2: Mouser; Supplier Part Number 2: 815-ABM3-25-D2Y-T; Supplier 3: Farnell; Supplier Part Number 3: 2101328
Y3 = SSPT7F-7PF20-R: CRYSTAL, 32.768KHZ, 7PF, SMD; Manufacturer: Seiko Instruments; SymbolCreator: x0208325; U/M: EA; TaMin_C: -40; TaMax_C: 85; Frequency Stability: ±20ppm; SymbolVersion: 2014-01-08; PartNumber: SSPT7F-7PF20-R; CompType: Crystal; PackageReference: 1.5x1.4x6.7mm; MountType: SMT; RoHS: Y; ComponentLink1Description: Datasheet Link; ComponentLink1URL: http://www.sii.co.jp/data/file_PRODUCT_MASTER_1309_GRAPHIC03.pdf; Publisher: Texas Instruments; LatestRevisionDate: 2015-10-19; Supplier 1: Digi-Key; Supplier Part Number 1: 728-1065-1-ND; Supplier 2: Mouser; Supplier Part Number 2: 628-SSPT7F-7PF20PPM